# Altium schematic sheet POWER_DELIVERY_AND_MONITORING.SchDoc
size A4; SheetNumber: 2; SheetTotal: 16
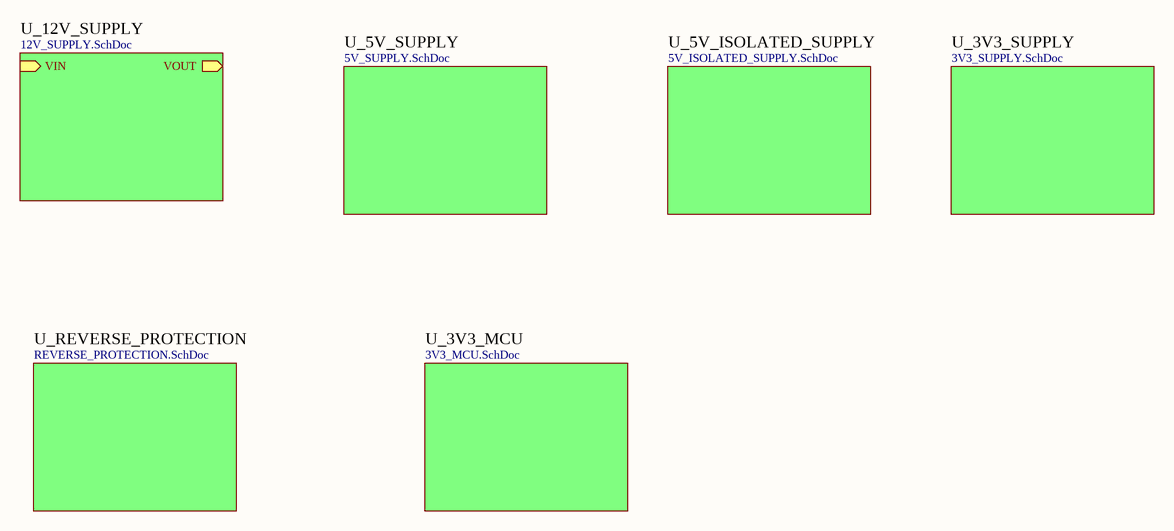
[diagram p0: POWER_DELIVERY_AND_MONITORING.SchDoc]

## Sub-sheets
U_3V3_MCU = 3V3_MCU.SchDoc: no entries
U_3V3_SUPPLY = 3V3_SUPPLY.SchDoc: no entries
U_5V_ISOLATED_SUPPLY = 5V_ISOLATED_SUPPLY.SchDoc: no entries
U_5V_SUPPLY = 5V_SUPPLY.SchDoc: no entries
U_12V_SUPPLY = 12V_SUPPLY.SchDoc: VIN (in), VOUT (out)
U_REVERSE_PROTECTION = REVERSE_PROTECTION.SchDoc: no entries